# Altium schematic sheet QCopterFC_LED_Sch.SchDoc
size A4
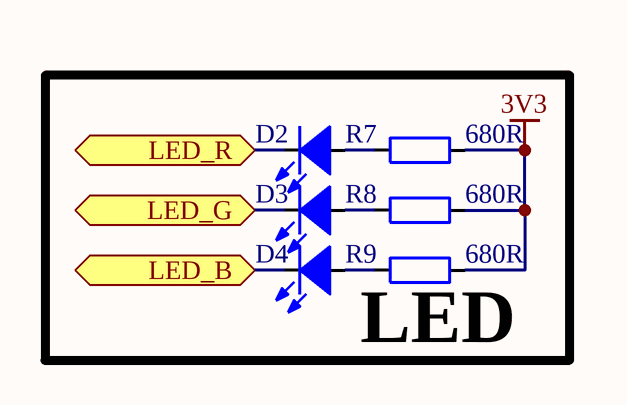
[diagram p0: QCopterFC_LED_Sch.SchDoc]

## Parts
D2  LED_0603  [LED_0603_RED]  (value not drawn)
D3  LED_0603  [LED_0603_GREEN]  (value not drawn)
D4  LED_0603  [LED_0603_BLUE]  (value not drawn)
R7  value 680R  [RES_0603]  (hidden comment: Res_0603)
R8  value 680R  [RES_0603]  (hidden comment: Res_0603)
R9  value 680R  [RES_0603]  (hidden comment: Res_0603)

## Blocks framed on the sheet
LED: D2-D4 R7-R9

## Ports
LED_B, LED_G, LED_R

## Nets
3V3: R7.1 R8.1 R9.1
LED_B: D4.2(K) ; port LED_B
LED_G: D3.2(K) ; port LED_G
LED_R: D2.2(K) ; port LED_R
NetD2_1: D2.1(A) R7.2
NetD3_1: D3.1(A) R8.2
NetD4_1: D4.1(A) R9.2

## Library data of the parts
D2-D4 = LED_0603: LED
R7-R9 = Res_0603: Resistor